# Altium schematic sheet BSPD-rev2.SchDoc
size B
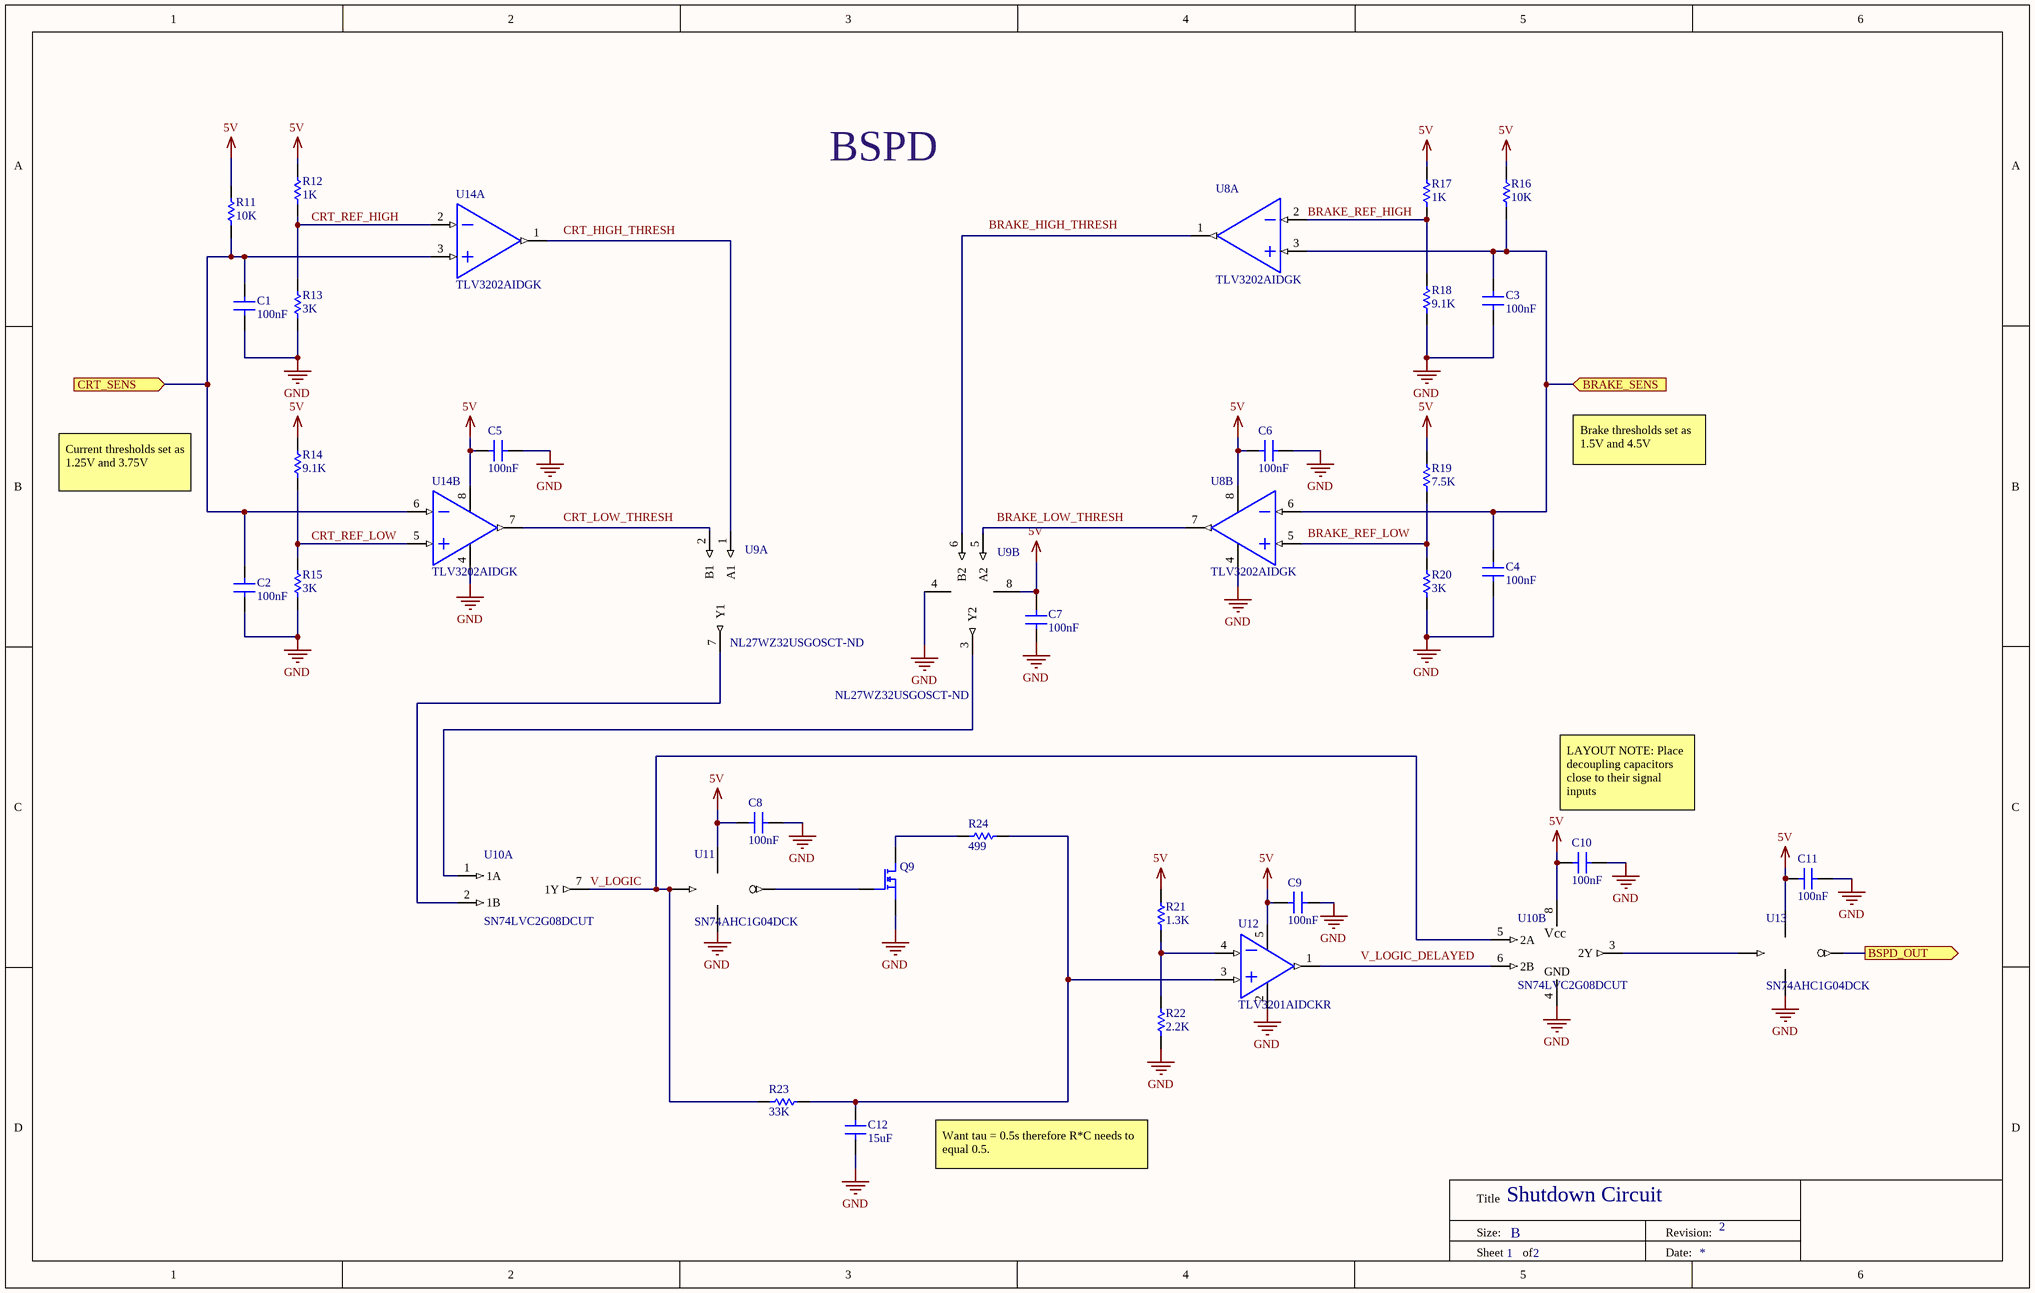
[diagram p0: BSPD-rev2.SchDoc]

## Parts
C1  100nF  [CAP-0603]
C2  100nF  [CAP-0603]
C3  100nF  [CAP-0603]
C4  100nF  [CAP-0603]
C5  100nF  [CAP-0603]
C6  100nF  [CAP-0603]
C7  100nF  [CAP-0603]
C8  100nF  [CAP-0603]
C9  100nF  [CAP-0603]
C10  100nF  [CAP-0603]
C11  100nF  [CAP-0603]
C12  15uF  [CAP-0603]
Q9  BSS138LT3G  [SOT-23-3]  (value not drawn)
R11  10K  [RES-0603]
R12  1K  [RES-0603]
R13  3K  [RES-0603]
R14  9.1K  [RES-0603]
R15  3K  [RES-0603]
R16  10K  [RES-0603]
R17  1K  [RES-0603]
R18  9.1K  [RES-0603]
R19  7.5K  [RES-0603]
R20  3K  [RES-0603]
R21  1.3K  [RES-0603]
R22  2.2K  [RES-0603]
R23  33K  [RES-0603]
R24  499  [RES-0603]
U8  TLV3202AIDGK  [TLV3202AIDGK]  (parts A,B of 2)
U9  NL27WZ32USGOSCT-ND  [TSSOP50P310X90-8N]  (parts A,B of 2)
U10  SN74LVC2G08DCUT  [SN74LVC2G08DCU]  (parts A,B of 2)
U11  SN74AHC1G04DCK  [SN74AHC1G04DCK]
U12  TLV3201AIDCKR  [TLV3201AIDCK]
U13  SN74AHC1G04DCK  [SN74AHC1G04DCK]
U14  TLV3202AIDGK  [TLV3202AIDGK]  (parts A,B of 2)

## Ports
BRAKE_SENS (in), BSPD_OUT (out), CRT_SENS (in)

## Nets
5V: C5.2 C6.2 C7.1 C8.2 C9.1 C10.2 C11.2 R11.2 R12.2 R14.2 R16.2 R17.2 R19.2 R21.2 U8.8(VCC) U9.8(VCC) U10.8(VCC) U11.5(VCC) U12.5(VCC) U13.5(VCC) U14.8(VCC)
GND: C1.1 C2.1 C3.1 C4.1 C5.1 C6.1 C7.2 C8.1 C9.2 C10.1 C11.1 C12.1 Q9.2 R13.1 R15.1 R18.1 R20.1 R22.1 U8.4(GND) U9.4(GND) U10.4(GND) U12.2(GND) U13.3(GND) U14.4(GND)
BRAKE_REF_HIGH: R17.1 R18.2 U8.2(1IN-)
BRAKE_SENS: C3.2 C4.2 R16.1 U8.3(1IN+) U8.6(2IN-) ; port BRAKE_SENS
BSPD_OUT: U13.4(Y) ; port BSPD_OUT
CRT_REF_HIGH: R12.1 R13.2 U14.2(1IN-)
CRT_REF_LOW: R14.1 R15.2 U14.5(2IN+)
CRT_SENS: C1.2 C2.2 R11.1 U14.3(1IN+) U14.6(2IN-) ; port CRT_SENS
V_LOGIC: R23.1 U10.5(2A) U10.7(1Y) U11.2(A)
NetC12_2: C12.2 R23.2 R24.2 U12.3(1IN+)
NetQ9_1: Q9.1 U11.4(Y)
NetQ9_3: Q9.3 R24.1
NetR19_1: R19.1 R20.2 U8.5(2IN+)
NetR21_1: R21.1 R22.2 U12.4(1IN-)
NetU8_1: U8.1(1OUT) U9.6(B2)
NetU8_7: U8.7(2OUT) U9.5(A2)
NetU9_1: U9.1(A1) U14.1(1OUT)
NetU9_2: U9.2(B1) U14.7(2OUT)
NetU9_3: U9.3(Y2) U10.1(1A)
NetU9_7: U9.7(Y1) U10.2(1B)
NetU10_3: U10.3(2Y) U13.2(A)
NetU10_6: U10.6(2B) U12.1(1OUT)

Not connected (* = marked no-connect by the designer): U11 3(GND)

## Notes on the sheet
- BSPD
- Current thresholds set as 1.25V and 3.75V
- Brake thresholds set as 1.5V and 4.5V
- (near C10) LAYOUT NOTE: Place decoupling capacitors close to their signal inputs
- Want tau = 0.5s therefore R*C needs to equal 0.5.
- Shutdown Circuit
- 2
- 1
- Labels drawn without touching a wire or pin: BRAKE_HIGH_THRESH, BRAKE_LOW_THRESH, BRAKE_REF_LOW, CRT_HIGH_THRESH, CRT_LOW_THRESH, GND, V_LOGIC_DELAYED
- Title
- Size:
- B
- Revision:
- Sheet
- of
- Date:
- (in symbol SN74LVC2G08DCUT, part B) Vcc

## Library data of the parts
C1-C11 = CL10B104KB8NNNL: CAP CER 0.1UF 50V X7R 0603; Manufacturer: Samsung; Manufacturer Part Number: CL21A106KPFNNNG; Capacitance: 10uF; Tolerance: 10%; Dielectric: X5R; Voltage: 10V; Supplier 1: Digi-Key; Stock 1: 0; Pricing 1: 1=0.15, 10=0.104, 100=0.0489, 500=0.03428, 1000=0.02837 (USD); Mount: Surface Mount; Case/Package: 0805; Case Code (Metric): 2012; Case Code (Imperial): 0805; Min Operating Temperature: -55°C; Max Operating Temperature: 85°C; Voltage Rating: 10V; Packaging: Tape and Reel; Package Quantity: 3000; Termination: Wraparound; Length: 2mm; Height: 1.25mm; Depth: 1.25mm; Width: 0.049inch; Thickness: 0.053inch; Radiation Hardening: No; Lead Free: Lead Free; ComponentLink1URL: http://www1.futureelectronics.com/doc/SAMSUNG/CL21A106KPFNNNG.pdf?src-supplier=Future+Electronics; ComponentLink1Description: http://www1.futureelectronics.com/doc/SAMSUNG/CL21A106KPFNNNG.pdf?src-supplier=Future+Electronics; ComponentLink2URL: https://www.verical.com/server-webapp/html/getDatasheet?partID=640497&src-supplier=Verical; ComponentLink2Description: https://www.verical.com/server-webapp/html/getDatasheet?partID=640497&src-supplier=Verical; Supplier Part Number 1: 1276-6456-1-ND
C12 = C1608X5R0J156M080AC: CAP CER 15UF 6.3V X5R 0603
Q9 = BSS138LT3G: MOSFET N-CH 50V 200MA SOT-23; Manufacturer: ON Semiconductor; Nominal Vgs: 500mV; Input Capacitance: 50pF; Number of Elements: 1; Max Power Dissipation: 225mW; Rds On Max: 3.5R; Turn-Off Delay Time: 20ns; Element Configuration: Single; Gate to Source Voltage (Vgs): 20V; Supplier 1: Digi-Key; Manufacturer Part Number: BSS138LT3G; Stock 1: 195647; Pricing 1: 1=0.45, 10=0.408, 100=0.2284, 500=0.12234, 1000=0.0832 (USD); Case/Package: SOT-23-3; Number of Pins: 3; Min Operating Temperature: -55°C; Max Operating Temperature: 150°C; Package Quantity: 1; Packaging: Tape and Reel; Drain to Source Voltage (Vdss): 50V; Continuous Drain Current (ID): 200mA; Drain to Source Breakdown Voltage: 50V; Power Dissipation: 225mW; Drain to Source Resistance: 3.5R; Threshold Voltage: 500mV; Turn-On Delay Time: 20ns; Voltage Rating (DC): 50V; Current Rating: 200mA; On-State Resistance: 3.5R; Length: 2.9mm; Height: 0.94mm; Width: 1.3mm; Radiation Hardening: No; REACH SVHC: No SVHC; Lead Free: Lead Free; Halogen Free: Halogen Free; Supplier Part Number 1: BSS138LT3GOSCT-ND; ComponentLink1Description: DigiKey; ComponentLink1URL: https://www.digikey.ca/product-detail/en/BSS138LT3G/BSS138LT3GOSCT-ND/2120566/?itemSeq=274498102
R11 R16 = CRCW060310K0FKEA: RES SMD 10K OHM 1% 1/10W 0603; Manufacturer: Vishay; Resistance: 10kR; Temperature Coefficient: 100ppm/°C; Power Rating: 100mW; Voltage Rating: 75V; Supplier 1: Digi-Key; Manufacturer Part Number: CRCW060310K0FKEA; Stock 1: 1434373; Pricing 1: 1=0.1, 10=0.034, 100=0.0139, 1000=0.00623, 2500=0.0054 (USD); Case/Package: 0603; Number of Pins: 2; Weight: 7.1E-05oz; Contact Plating: Tin,Lead; Case Code (Metric): 1608; Case Code (Imperial): 0603; Min Operating Temperature: -55°C; Max Operating Temperature: 155°C; Tolerance: 1%; Composition: Thick Film; Packaging: Tape and Reel; Package Quantity: 10; Number of Terminations: 2; Military Standard: Not; Termination: SMD/SMT; Max Power Dissipation: 100mW; Voltage Rating (DC): 75V; Features: Automotive AEC-Q200; Length: 1.55mm; Height: 0.45mm; Width: 0.033inch; Depth: 0.85mm; Radiation Hardening: No; Lead Free: Lead Free; REACH SVHC: Unknown; ComponentLink1URL: http://www.vishay.com/docs/20008/dcrcw.pdf?src-supplier=Avnet+Europe; ComponentLink1Description: http://www.vishay.com/docs/20008/dcrcw.pdf?src-supplier=Avnet+Europe; ComponentLink2URL: https://www.verical.com/server-webapp/html/getDatasheet?partID=86831&src-supplier=Verical; ComponentLink2Description: https://www.verical.com/server-webapp/html/getDatasheet?partID=86831&src-supplier=Verical; ComponentLink3URL: http://www.farnell.com/datasheets/2310790.pdf?src-supplier=Allied+Electronics; ComponentLink3Description: http://www.farnell.com/datasheets/2310790.pdf?src-supplier=Allied+Electronics; ComponentLink4URL: http://www.vishay.com/docs/20035/dcrcwe3.pdf?src-supplier=Digi-Key; ComponentLink4Description: http://www.vishay.com/docs/20035/dcrcwe3.pdf?src-supplier=Digi-Key; ComponentLink5URL: http://www.farnell.com/datasheets/2310790.pdf?src-supplier=Mouser; ComponentLink5Description: http://www.farnell.com/datasheets/2310790.pdf?src-supplier=Mouser; ComponentLink6URL: http://www.farnell.com/datasheets/2310790.pdf?src-supplier=Element14; ComponentLink6Description: http://www.farnell.com/datasheets/2310790.pdf?src-supplier=Element14; ComponentLink7URL: http://www.farnell.com/datasheets/2310790.pdf?src-supplier=Avnet; ComponentLink7Description: http://www.farnell.com/datasheets/2310790.pdf?src-supplier=Avnet; ComponentLink8URL: http://www.vishay.com/docs/20035/dcrcwe3.pdf?src-supplier=Future+Electronics; ComponentLink8Description: http://www.vishay.com/docs/20035/dcrcwe3.pdf?src-supplier=Future+Electronics; ComponentLink9URL: http://uk.rs-online.com/webdocs/0d98/0900766b80d98afc.pdf?src-supplier=RSComponents; ComponentLink9Description: http://uk.rs-online.com/webdocs/0d98/0900766b80d98afc.pdf?src-supplier=RSComponents; ComponentLink10URL: http://www.farnell.com/datasheets/2310790.pdf?src-supplier=Distrelec; ComponentLink10Description: http://www.farnell.com/datasheets/2310790.pdf?src-supplier=Distrelec; Supplier Part Number 1: 541-10.0KHCT-ND; Category: Resistors
R12 R17 = CRCW06031K00FKEA: RES SMD 1K OHM 1% 1/10W 0603; Manufacturer: Vishay Dale; Resistance: 1kR; Temperature Coefficient: 100ppm/°C; Power Rating: 100mW; Voltage Rating: 75V; Supplier 1: Digi-Key; Manufacturer Part Number: CRCW06031K00FKEA; Stock 1: 1811474; Pricing 1: 1=0.1, 10=0.034, 100=0.0139, 1000=0.00623, 2500=0.0054 (USD); Mount: Surface Mount; Case/Package: 0603; Number of Pins: 2; Weight: 7.1E-05oz; Contact Plating: Tin; Case Code (Metric): 1608; Case Code (Imperial): 0603; Min Operating Temperature: -55°C; Max Operating Temperature: 155°C; Composition: Thick Film; Tolerance: 1%; Termination: SMD/SMT; Packaging: Tape and Reel; Package Quantity: 10; Number of Terminations: 2; Military Standard: Not; Max Power Dissipation: 100mW; Voltage Rating (DC): 75V; Features: Automotive AEC-Q200; Length: 1.55mm; Height: 0.45mm; Width: 0.033inch; Depth: 0.85mm; Radiation Hardening: No; Lead Free: Lead Free; REACH SVHC: Unknown; ComponentLink1URL: http://www.vishay.com/docs/20035/dcrcwe3.pdf?src-supplier=Digi-Key; ComponentLink1Description: http://www.vishay.com/docs/20035/dcrcwe3.pdf?src-supplier=Digi-Key; ComponentLink2URL: http://uk.rs-online.com/webdocs/0d98/0900766b80d98afc.pdf?src-supplier=RSComponents; ComponentLink2Description: http://uk.rs-online.com/webdocs/0d98/0900766b80d98afc.pdf?src-supplier=RSComponents; ComponentLink3URL: http://www.vishay.com/docs/20035/dcrcwe3.pdf?src-supplier=Avnet; ComponentLink3Description: http://www.vishay.com/docs/20035/dcrcwe3.pdf?src-supplier=Avnet; ComponentLink4URL: http://www.vishay.com/docs/20035/dcrcwe3.pdf?src-supplier=Avnet+Asia; ComponentLink4Description: http://www.vishay.com/docs/20035/dcrcwe3.pdf?src-supplier=Avnet+Asia; ComponentLink5URL: http://www.farnell.com/datasheets/2310790.pdf?src-supplier=Element14; ComponentLink5Description: http://www.farnell.com/datasheets/2310790.pdf?src-supplier=Element14; ComponentLink6URL: https://www.distrelec.biz/Web/Downloads/a_/en/flD-CRCW-e3_data_en.pdf?mime=application%2Fpdf&src-supplier=Distrelec; ComponentLink6Description: https://www.distrelec.biz/Web/Downloads/a_/en/flD-CRCW-e3_data_en.pdf?mime=application%2Fpdf&src-supplier=Distrelec; ComponentLink7URL: http://www.vishay.com/docs/20035/dcrcwe3.pdf?src-supplier=Future+Electronics; ComponentLink7Description: http://www.vishay.com/docs/20035/dcrcwe3.pdf?src-supplier=Future+Electronics; ComponentLink8URL: http://www.vishay.com/docs/20035/dcrcwe3.pdf?src-supplier=Avnet+Europe; ComponentLink8Description: http://www.vishay.com/docs/20035/dcrcwe3.pdf?src-supplier=Avnet+Europe; Supplier Part Number 1: 541-1.00KHCT-ND; Category: Resistors
R13 R15 R20 = RMCF0603JT3K00: RES 3K OHM 5% 1/10W 0603
R14 R18 = RMCF0603FT9K10: RES 9.1K OHM 1% 1/10W 0603
R19 = RNCP0603FTD7K50: RES 7.5K OHM 1% 1/8W 0603
R21 = MCT06030C1301FP500: RES SMD 1.3K OHM 1% 1/8W 0603
R22 = RC0603FR-072K2L: RES SMD 2.2K OHM 1% 1/10W 0603
R23 = RC0603FR-0733KL: RES SMD 33K OHM 1% 1/10W 0603
R24 = ERA-3AEB4990V: RES SMD 499 OHM 0.1% 1/10W 0603
U8 U14 = TLV3202AIDGK: IC COMPAR PWR RRI DL PP 8VSSOP; Manufacturer: Texas Instruments; Min Supply Voltage: 2.7V; Max Supply Voltage: 5.5V; Number of Elements: 2; Nominal Supply Current: 50uA; Max Supply Current: 40uA; Input Bias Current: 50pA; Input Offset Voltage (Vos): 5mV; Response Time: 0.047us; Propagation Delay: 50ns; Common Mode Rejection Ratio: 70dB; Hysteresis: 1.2mV; Power Supply Rejection Ratio (PSRR): 85dB; ComponentLink1Description: digikey.ca; ComponentLink1URL: https://www.digikey.ca/product-detail/en/texas-instruments/TLV3202AIDGK/296-34992-ND/3588984; Supplier 1: Digi-Key; Manufacturer Part Number: TLV3202AIDGK; Stock 1: 14534; Pricing 1: 1=1.77, 80=1.5, 160=1.278, 560=1.05, 1040=0.87 (USD); Mount: Surface Mount; Case/Package: VSSOP; Number of Pins: 8; Min Operating Temperature: -40°C; Max Operating Temperature: 125°C; Packaging: Rail/Tube; Package Quantity: 80; Number of Channels: 2; Max Input Current: 50pA; Quiescent Current: 50uA; Type: General Purpose; Length: 3.1mm; Height: 0.95mm; Width: 3.1mm; Radiation Hardening: No; Lead Free: Lead Free; REACH SVHC: No SVHC; ComponentLink2URL: https://datasheet.ciiva.com/12288/tlv3202-193866-12288098.pdf; ComponentLink2Description: https://datasheet.ciiva.com/12288/tlv3202-193866-12288098.pdf; ComponentLink3URL: https://datasheet.ciiva.com/23702/1645741-23702136.pdf; ComponentLink3Description: https://datasheet.ciiva.com/23702/1645741-23702136.pdf; ComponentLink4URL: https://datasheet.ciiva.com/8066/1645741-8066013.pdf; ComponentLink4Description: https://datasheet.ciiva.com/8066/1645741-8066013.pdf; Supplier Part Number 1: 296-34992-ND; Supplier 2: Digi-Key
U9 = NL27WZ32USGOSCT-ND: IC GATE OR 2CH 2-INP US8; Manufacturer: ON Semiconductor; Number of Gates: 2; Propagation Delay: 6.2ns; Max Supply Voltage: 5.5V; Min Supply Voltage: 1.65V; Number of Outputs: 1; Operating Supply Voltage: 3.25V; Schmitt Trigger Input: No; Low Level Output Current: 32mA; Quiescent Current: 1uA; High Level Output Current: -32mA; Turn-On Delay Time: 5.2ns; Output Current: 50mA; Supplier 1: Digi-Key; Manufacturer Part Number: NL27WZ32USG; Stock 1: 5684; Pricing 1: 1=0.39000, 10=0.31700, 25=0.29000, 100=0.21570, 250=0.19548, 500=0.16176, 1000=0.12132 (USD); RoHS: Yes; Mount: Surface Mount; Number of Pins: 8; Contact Plating: Tin,Matte; Min Operating Temperature: -40°C; Max Operating Temperature: 85°C; Packaging: Tape and Reel; Package Quantity: 1; Number of Inputs: 2; Logic Function: OR; Number of Circuits: 2; Number of Elements: 2; Length: 2.4mm; Height: 0.8mm; Width: 2.1mm; Radiation Hardening: No; REACH SVHC: No SVHC; Lead Free: Lead Free; Halogen Free: Halogen Free; ComponentLink1URL: https://datasheet.ciiva.com/8277/nl27wz32-d-8277742.pdf?src-supplier=Avnet; ComponentLink1Description: https://datasheet.ciiva.com/8277/nl27wz32-d-8277742.pdf?src-supplier=Avnet; ComponentLink2URL: https://datasheet.ciiva.com/4820/nl27wz32-d-114831-4820790.pdf?src-supplier=Mouser; ComponentLink2Description: https://datasheet.ciiva.com/4820/nl27wz32-d-114831-4820790.pdf?src-supplier=Mouser; ComponentLink3URL: https://datasheet.ciiva.com/15090/getdatasheetpartid-69948-15090488.pdf?src-supplier=Verical; ComponentLink3Description: https://datasheet.ciiva.com/15090/getdatasheetpartid-69948-15090488.pdf?src-supplier=Verical; ComponentLink4URL: https://datasheet.ciiva.com/26864/nl27wz32usg-26864780.pdf?src-supplier=IIIC; ComponentLink4Description: https://datasheet.ciiva.com/26864/nl27wz32usg-26864780.pdf?src-supplier=IIIC; ComponentLink5URL: https://datasheet.ciiva.com/1872/nl27wz32-d-1872823.pdf?src-supplier=Digi-Key; ComponentLink5Description: https://datasheet.ciiva.com/1872/nl27wz32-d-1872823.pdf?src-supplier=Digi-Key; ComponentLink6URL: https://datasheet.ciiva.com/26049/nl27wz32-d-26049116.pdf?src-supplier=Avnet+Europe; ComponentLink6Description: https://datasheet.ciiva.com/26049/nl27wz32-d-26049116.pdf?src-supplier=Avnet+Europe; ComponentLink7URL: https://datasheet.ciiva.com/1872/nl27wz32-d-1872824.pdf?src-supplier=Digi-Key; ComponentLink7Description: https://datasheet.ciiva.com/1872/nl27wz32-d-1872824.pdf?src-supplier=Digi-Key; ComponentLink8URL: https://datasheet.ciiva.com/1872/nl27wz32-d-1872825.pdf?src-supplier=Digi-Key; ComponentLink8Description: https://datasheet.ciiva.com/1872/nl27wz32-d-1872825.pdf?src-supplier=Digi-Key; ComponentLink9URL: https://datasheet.ciiva.com/16471/nl27wz32-d-16471564.pdf?src-supplier=Future+Electronics; ComponentLink9Description: https://datasheet.ciiva.com/16471/nl27wz32-d-16471564.pdf?src-supplier=Future+Electronics; Supplier Part Number 1: NL27WZ32USGOSCT-ND
U10 = SN74LVC2G08DCUT: Dual 2-Input Positive-AND Gate; Manufacturer: Texas Instruments; Output Current: 32mA; Number of Inputs: 2; Min Supply Voltage: 1.65V; Max Supply Voltage: 5.5V; Logic Function: AND; Number of Outputs: 1; Propagation Delay: 3.8ns; Quiescent Current: 10uA; High Level Output Current: -32mA; Supplier 1: Digi-Key; ComponentLink1Description: Digi-Key; ComponentLink1URL: https://www.digikey.ca/product-detail/en/texas-instruments/SN74LVC2G08DCUT/296-26615-1-ND/2255073; Supplier Part Number 1: 296-26615-1-ND; Manufacturer Part Number: SN74LVC2G08DCUT; Stock 1: 2440; Pricing 1: 1=0.86, 10=0.769, 100=0.5994 (USD); Mount: Surface Mount; Case/Package: VSSOP; Number of Pins: 8; Weight: 0.000339oz; Contact Plating: Gold; Min Operating Temperature: -40°C; Max Operating Temperature: 125°C; Max Output Current: 32mA; Packaging: Tape and Reel; Package Quantity: 1; Number of Gates: 2; Number of Input Lines: 2; Number of Output Lines: 1; Low Level Output Current: 32mA; Number of Circuits: 2; Number of Elements: 2; Turn-On Delay Time: 3.8ns; Termination: SMD/SMT; Number of Bits: 2; Radiation Hardening: No; REACH SVHC: No SVHC; Lead Free: Lead Free; ComponentLink2URL: http://focus.ti.com/lit/ds/symlink/sn74lvc2g08.pdf?src-supplier=Element14; ComponentLink2Description: http://focus.ti.com/lit/ds/symlink/sn74lvc2g08.pdf?src-supplier=Element14; ComponentLink3URL: http://focus.ti.com/lit/ds/symlink/sn74lvc2g08.pdf?src-supplier=Avnet; ComponentLink3Description: http://focus.ti.com/lit/ds/symlink/sn74lvc2g08.pdf?src-supplier=Avnet; ComponentLink4URL: http://www.ti.com/general/docs/lit/getliterature.tsp?genericPartNumber=SN74LVC2G08&&fileType=pdf&src-supplier=Avnet; ComponentLink4Description: http://www.ti.com/general/docs/lit/getliterature.tsp?genericPartNumber=SN74LVC2G08&&fileType=pdf&src-supplier=Avnet; ComponentLink5URL: https://www.verical.com/server-webapp/html/getDatasheet?partID=48823&src-supplier=Verical; ComponentLink5Description: https://www.verical.com/server-webapp/html/getDatasheet?partID=48823&src-supplier=Verical; ComponentLink6URL: http://www.farnell.com/datasheets/1834894.pdf?src-supplier=Element14; ComponentLink6Description: http://www.farnell.com/datasheets/1834894.pdf?src-supplier=Element14; ComponentLink7URL: http://www.ti.com/lit/ds/symlink/sn74lvc2g08.pdf?src-supplier=Digi-Key; ComponentLink7Description: http://www.ti.com/lit/ds/symlink/sn74lvc2g08.pdf?src-supplier=Digi-Key; ComponentLink8URL: http://www.produktinfo.conrad.com/datenblaetter/1000000-1099999/001017175-da-01-en-IC_DU_2IN_PO_SN74LVC2G08DCUT_VSSOP_8_TID.pdf?src-supplier=Conrad; ComponentLink8Description: http://www.produktinfo.conrad.com/datenblaetter/1000000-1099999/001017175-da-01-en-IC_DU_2IN_PO_SN74LVC2G08DCUT_VSSOP_8_TID.pdf?src-supplier=Conrad
U11 U13 = SN74AHC1G04DCK: The SN74AHC1G04 contains one inverter gate. The / device performs the Boolean function Y = A bar.; Manufacturer: Texas Instruments; Manufacturer Part Number: SN74AHC1G04DCKR; Output Current: 8mA; Number of Inputs: 1; Min Supply Voltage: 2V; Max Supply Voltage: 5.5V; Logic Function: Buffer,Inverter,Inverting; Propagation Delay: 12ns; Quiescent Current: 1uA; High Level Output Current: -8mA; Turn-On Delay Time: 10.6ns; Schmitt Trigger Input: No; Supplier 1: Digi-Key; ComponentLink1Description: Digi-Key; ComponentLink1URL: https://www.digikey.com/product-detail/en/texas-instruments/SN74AHC1G04DCKR/296-1090-1-ND/276358; Supplier Part Number 1: 296-1090-1-ND; Stock 1: 120362; Pricing 1: 1=0.43, 10=0.32, 100=0.1996, 500=0.13658, 1000=0.10506 (USD); Mount: Surface Mount; Case/Package: SC; Number of Pins: 5; Weight: 8.8E-05oz; Contact Plating: Gold; Min Operating Temperature: -40°C; Max Operating Temperature: 125°C; Max Output Current: 8mA; Number of Elements: 1; Packaging: Tape and Reel; Package Quantity: 1; Number of Circuits: 1; Low Level Output Current: 8mA; Termination: SMD/SMT; Number of Gates: 1; Number of Bits: 1; Length: 2mm; Height: 0.9mm; Width: 1.25mm; Radiation Hardening: No; REACH SVHC: No SVHC; Lead Free: Lead Free; ComponentLink2URL: http://www.farnell.com/datasheets/1759812.pdf?src-supplier=Element14; ComponentLink2Description: http://www.farnell.com/datasheets/1759812.pdf?src-supplier=Element14; ComponentLink3URL: http://www.jameco.com/Jameco/Products/ProdDS/912915.pdf?src-supplier=Jameco; ComponentLink3Description: http://www.jameco.com/Jameco/Products/ProdDS/912915.pdf?src-supplier=Jameco; ComponentLink4URL: http://www.ti.com/lit/ds/symlink/sn74ahc1g04.pdf?src-supplier=Digi-Key; ComponentLink4Description: http://www.ti.com/lit/ds/symlink/sn74ahc1g04.pdf?src-supplier=Digi-Key; ComponentLink5URL: https://www.verical.com/server-webapp/html/getDatasheet?partID=53378&src-supplier=Verical; ComponentLink5Description: https://www.verical.com/server-webapp/html/getDatasheet?partID=53378&src-supplier=Verical; ComponentLink6URL: http://www.farnell.com/datasheets/2024272.pdf?src-supplier=Element14; ComponentLink6Description: http://www.farnell.com/datasheets/2024272.pdf?src-supplier=Element14; ComponentLink7URL: http://www.ti.com/general/docs/lit/getliterature.tsp?genericPartNumber=SN74AHC1G04&amp;&amp;fileType=pdf&src-supplier=Avnet+Asia; ComponentLink7Description: http://www.ti.com/general/docs/lit/getliterature.tsp?genericPartNumber=SN74AHC1G04&amp;&amp;fileType=pdf&src-supplier=Avnet+Asia
U12 = TLV3201AIDCKR: Comparator Single R-R I/P 5.5V 5-Pin SC-70 T/R; Manufacturer: Texas Instruments; Common Mode Rejection Ratio: 85dB; Min Supply Voltage: 2.7V; Number of Elements: 1; Propagation Delay: 50ns; Nominal Supply Current: 50uA; Input Offset Voltage (Vos): 5mV; Input Bias Current: 5nA; Quiescent Current: 40uA; Hysteresis: 1.2mV; Response Time: 0.047us; Supplier 1: Digi-Key; Manufacturer Part Number: TLV3201AIDCKR; Stock 1: 34988; Pricing 1: 1=1.36000, 10=1.21500, 100=0.94760, 500=0.78280, 1000=0.61800 (USD); RoHS: Yes; Mount: Surface Mount; Case/Package: SOT-23-5; Number of Pins: 5; Min Operating Temperature: -40°C; Max Operating Temperature: 125°C; Max Supply Voltage: 5.5V; Packaging: Tape and Reel; Package Quantity: 3000; Max Input Current: 5nA; Max Supply Current: 40uA; Number of Channels: 1; Power Supply Rejection Ratio (PSRR): 85dB; Type: General Purpose; Radiation Hardening: No; Lead Free: Lead Free; ComponentLink1URL: https://datasheet.ciiva.com/29635/tlv3201-29635045.pdf?src-supplier=Digi-Key; ComponentLink1Description: https://datasheet.ciiva.com/29635/tlv3201-29635045.pdf?src-supplier=Digi-Key; ComponentLink2URL: https://datasheet.ciiva.com/2966/tlv3202-2966812.pdf?src-supplier=Avnet; ComponentLink2Description: https://datasheet.ciiva.com/2966/tlv3202-2966812.pdf?src-supplier=Avnet; Supplier Part Number 1: 296-36751-1-ND